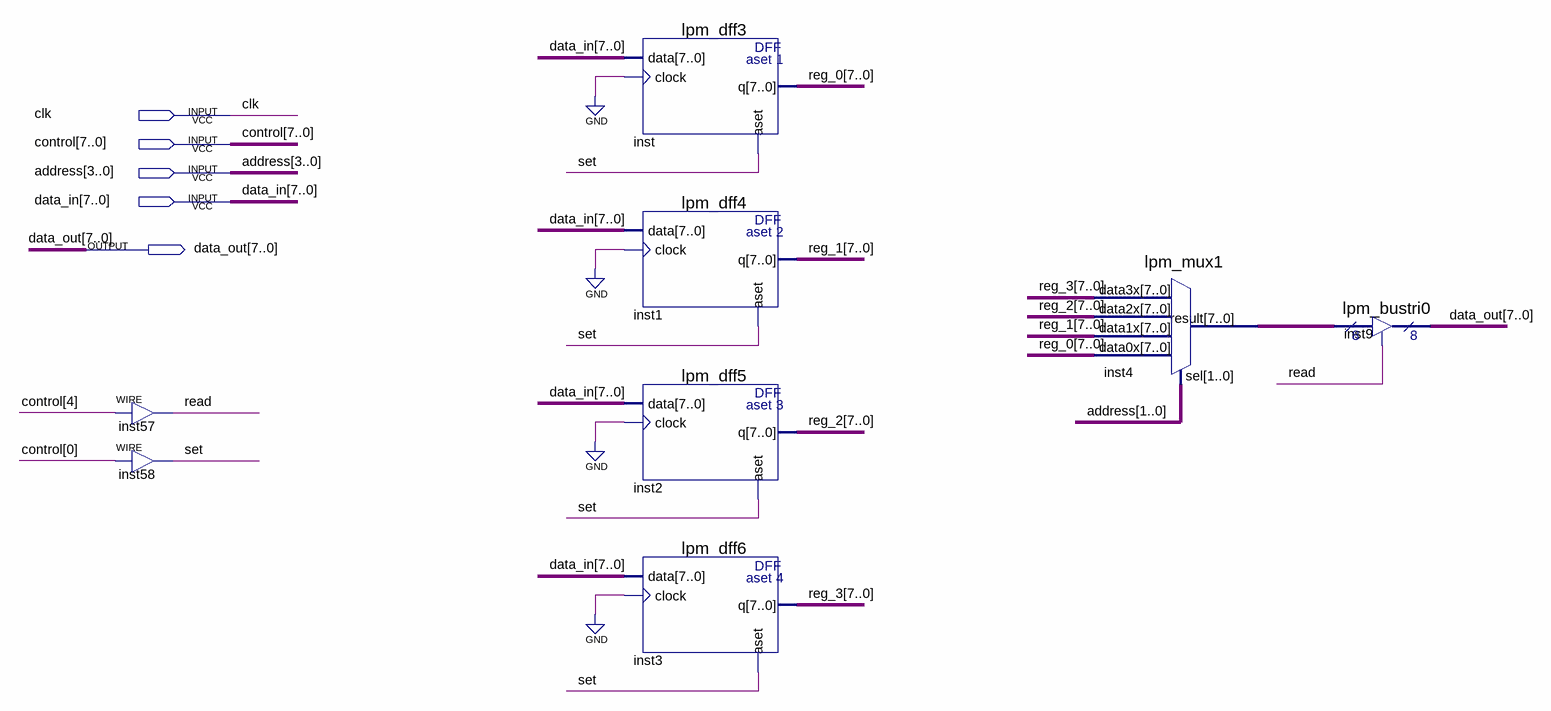
[diagram p0: schematic sheet]
// Quartus schematic RON.bdf as structural Verilog: 8 symbols, 5 pins
module RON (
  input  clk,
  input  [7:0] control,
  input  [3:0] address,
  input  [7:0] data_in,
  output [7:0] data_out
);

  wire read, set;
  wire [7:0] inst4_result, reg_0, reg_1, reg_2, reg_3;

  assign read = control[4];  // WIRE inst57
  assign set = control[0];  // WIRE inst58
  lpm_dff3 inst (.data(data_in), .clock(1'b0), .aset(set), .q(reg_0));
  lpm_dff4 inst1 (.data(data_in), .clock(1'b0), .aset(set), .q(reg_1));
  lpm_dff5 inst2 (.data(data_in), .clock(1'b0), .aset(set), .q(reg_2));
  lpm_dff6 inst3 (.data(data_in), .clock(1'b0), .aset(set), .q(reg_3));
  lpm_mux1 inst4 (
    .data3x(reg_3), .data2x(reg_2), .data1x(reg_1), .data0x(reg_0), .sel(address[1:0]), .result(inst4_result));
  lpm_bustri0 inst9 (.enabledt(read), .data(inst4_result), .tridata(data_out));
endmodule
